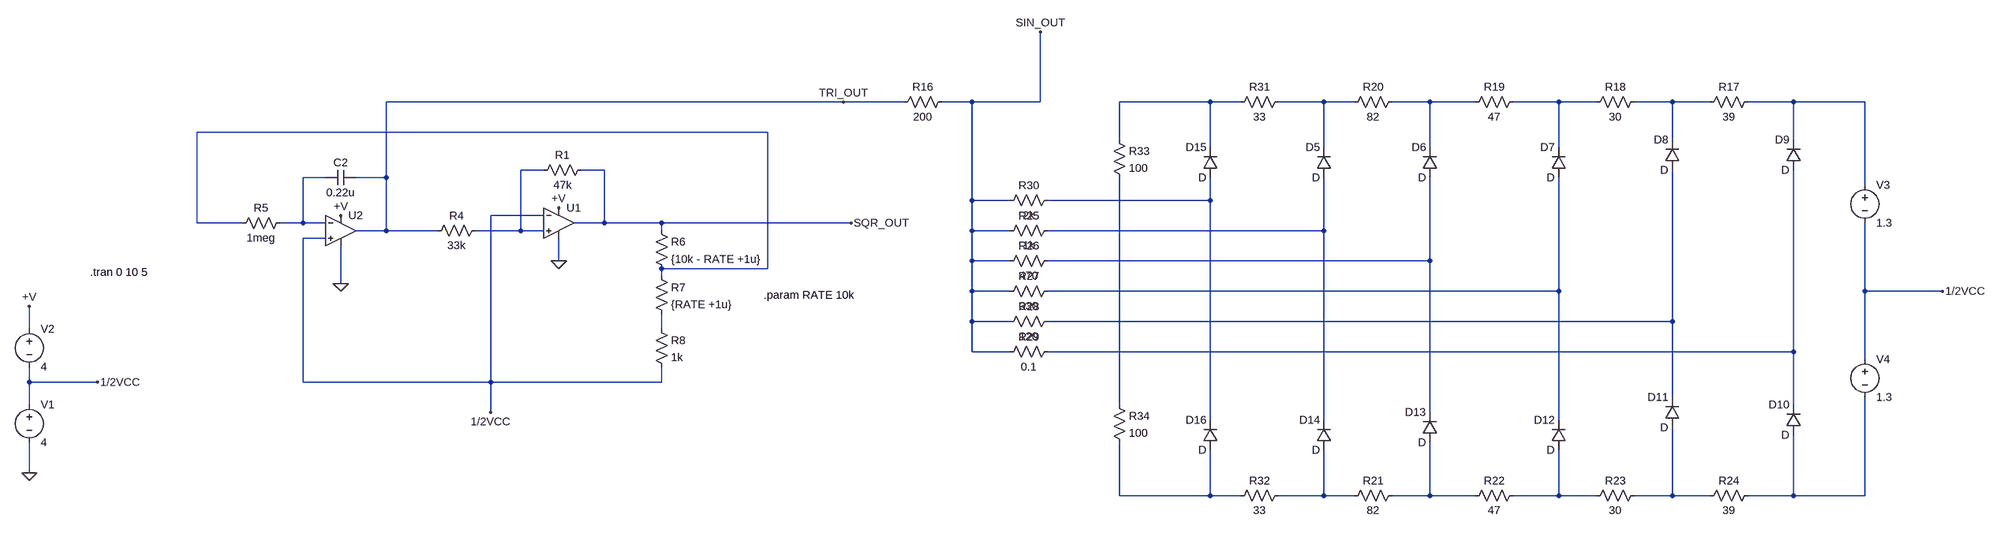
[diagram p0: schematic LFO_TRI_SIN.asc]
LFO_TRI_SIN.asc, the LTspice schematic file:
Version 4
SHEET 1 880 792
WIRE -2032 -1312 -3008 -1312
WIRE -1904 -1312 -2032 -1312
WIRE -1760 -1312 -1824 -1312
WIRE -1616 -1312 -1616 -1472
WIRE -1616 -1312 -1760 -1312
WIRE -1200 -1312 -1392 -1312
WIRE -1136 -1312 -1200 -1312
WIRE -960 -1312 -1056 -1312
WIRE -896 -1312 -960 -1312
WIRE -736 -1312 -816 -1312
WIRE -640 -1312 -736 -1312
WIRE -464 -1312 -560 -1312
WIRE -384 -1312 -464 -1312
WIRE -224 -1312 -304 -1312
WIRE -144 -1312 -224 -1312
WIRE 32 -1312 -64 -1312
WIRE 448 -1312 32 -1312
WIRE -2192 -1248 -3408 -1248
WIRE -1392 -1232 -1392 -1312
WIRE -224 -1232 -224 -1312
WIRE 32 -1232 32 -1312
WIRE -1200 -1216 -1200 -1312
WIRE -960 -1216 -960 -1312
WIRE -736 -1216 -736 -1312
WIRE -464 -1216 -464 -1312
WIRE -2672 -1168 -2720 -1168
WIRE -2544 -1168 -2592 -1168
WIRE -3136 -1152 -3184 -1152
WIRE -3008 -1152 -3008 -1312
WIRE -3008 -1152 -3072 -1152
WIRE 448 -1136 448 -1312
WIRE -1760 -1104 -1760 -1312
WIRE -1680 -1104 -1760 -1104
WIRE -1200 -1104 -1200 -1152
WIRE -1200 -1104 -1600 -1104
WIRE -2672 -1072 -2784 -1072
WIRE -3408 -1056 -3408 -1248
WIRE -3312 -1056 -3408 -1056
WIRE -3184 -1056 -3184 -1152
WIRE -3184 -1056 -3232 -1056
WIRE -3136 -1056 -3184 -1056
WIRE -2544 -1056 -2544 -1168
WIRE -2544 -1056 -2608 -1056
WIRE -2416 -1056 -2544 -1056
WIRE -2016 -1056 -2416 -1056
WIRE -3008 -1040 -3008 -1152
WIRE -3008 -1040 -3072 -1040
WIRE -2896 -1040 -3008 -1040
WIRE -2720 -1040 -2720 -1168
WIRE -2720 -1040 -2816 -1040
WIRE -2672 -1040 -2720 -1040
WIRE -2416 -1040 -2416 -1056
WIRE -1760 -1040 -1760 -1104
WIRE -1680 -1040 -1760 -1040
WIRE -960 -1040 -960 -1152
WIRE -960 -1040 -1600 -1040
WIRE -3136 -1024 -3184 -1024
WIRE -2640 -976 -2640 -1024
WIRE -1760 -976 -1760 -1040
WIRE -1680 -976 -1760 -976
WIRE -736 -976 -736 -1152
WIRE -736 -976 -1600 -976
WIRE -2192 -960 -2192 -1248
WIRE -2192 -960 -2416 -960
WIRE -2416 -944 -2416 -960
WIRE -3104 -928 -3104 -1008
WIRE -1760 -912 -1760 -976
WIRE -1680 -912 -1760 -912
WIRE -464 -912 -464 -1152
WIRE -464 -912 -1600 -912
WIRE 448 -912 448 -1056
WIRE 752 -912 448 -912
WIRE -1760 -848 -1760 -912
WIRE -1680 -848 -1760 -848
WIRE -224 -848 -224 -1168
WIRE -224 -848 -1600 -848
WIRE -3872 -832 -3872 -880
WIRE -2416 -832 -2416 -864
WIRE -1760 -784 -1760 -848
WIRE -1680 -784 -1760 -784
WIRE 32 -784 32 -1168
WIRE 32 -784 -1600 -784
WIRE 448 -768 448 -912
WIRE -3872 -720 -3872 -752
WIRE -3728 -720 -3872 -720
WIRE -3184 -720 -3184 -1024
WIRE -2784 -720 -2784 -1072
WIRE -2784 -720 -3184 -720
WIRE -2416 -720 -2416 -752
WIRE -2416 -720 -2784 -720
WIRE -224 -688 -224 -848
WIRE -3872 -672 -3872 -720
WIRE -1392 -672 -1392 -1152
WIRE 32 -672 32 -784
WIRE -2784 -656 -2784 -720
WIRE -736 -656 -736 -976
WIRE -1200 -640 -1200 -1104
WIRE -960 -640 -960 -1040
WIRE -464 -640 -464 -912
WIRE -3872 -528 -3872 -592
WIRE -1392 -480 -1392 -592
WIRE -1200 -480 -1200 -576
WIRE -1200 -480 -1392 -480
WIRE -1136 -480 -1200 -480
WIRE -960 -480 -960 -576
WIRE -960 -480 -1056 -480
WIRE -896 -480 -960 -480
WIRE -736 -480 -736 -592
WIRE -736 -480 -816 -480
WIRE -640 -480 -736 -480
WIRE -464 -480 -464 -576
WIRE -464 -480 -560 -480
WIRE -384 -480 -464 -480
WIRE -224 -480 -224 -624
WIRE -224 -480 -304 -480
WIRE -144 -480 -224 -480
WIRE 32 -480 32 -608
WIRE 32 -480 -64 -480
WIRE 448 -480 448 -688
WIRE 448 -480 32 -480
FLAG -3872 -528 0
FLAG -3872 -880 +V
FLAG -2640 -1088 +V
FLAG -2640 -976 0
FLAG -3104 -1072 +V
FLAG -3104 -928 0
FLAG -2784 -656 1/2VCC
FLAG -2016 -1056 SQR_OUT
FLAG -2032 -1312 TRI_OUT
FLAG -3728 -720 1/2VCC
FLAG 752 -912 1/2VCC
FLAG -1616 -1472 SIN_OUT
SYMBOL voltage -3872 -688 R0
WINDOW 123 0 0 Left 2
WINDOW 39 0 0 Left 2
SYMATTR InstName V1
SYMATTR Value 4
SYMBOL res -2576 -1184 R90
WINDOW 0 0 56 VBottom 2
WINDOW 3 32 56 VTop 2
SYMATTR InstName R1
SYMATTR Value 47k
SYMBOL res -2800 -1056 R90
WINDOW 0 0 56 VBottom 2
WINDOW 3 32 56 VTop 2
SYMATTR InstName R4
SYMATTR Value 33k
SYMBOL res -3216 -1072 R90
WINDOW 0 0 56 VBottom 2
WINDOW 3 32 56 VTop 2
SYMATTR InstName R5
SYMATTR Value 1meg
SYMBOL res -2432 -1056 R0
SYMATTR InstName R6
SYMATTR Value {10k - RATE +1u}
SYMBOL res -2432 -960 R0
SYMATTR InstName R7
SYMATTR Value {RATE +1u}
SYMBOL cap -3072 -1168 R90
WINDOW 0 0 32 VBottom 2
WINDOW 3 32 32 VTop 2
SYMATTR InstName C2
SYMATTR Value 0.22u
SYMBOL res -2432 -848 R0
SYMATTR InstName R8
SYMATTR Value 1k
SYMBOL Opamps\\UniversalOpamp2 -2640 -1056 R0
SYMATTR InstName U1
SYMBOL Opamps\\UniversalOpamp2 -3104 -1040 R0
SYMATTR InstName U2
SYMBOL voltage -3872 -848 R0
WINDOW 123 0 0 Left 2
WINDOW 39 0 0 Left 2
SYMATTR InstName V2
SYMATTR Value 4
SYMBOL res -1808 -1328 R90
WINDOW 0 0 56 VBottom 2
WINDOW 3 32 56 VTop 2
SYMATTR InstName R16
SYMATTR Value 200
SYMBOL diode -944 -1152 R180
WINDOW 0 24 64 Left 2
WINDOW 3 24 0 Left 2
SYMATTR InstName D5
SYMBOL diode -720 -1152 R180
WINDOW 0 24 64 Left 2
WINDOW 3 24 0 Left 2
SYMATTR InstName D6
SYMBOL diode -448 -1152 R180
WINDOW 0 24 64 Left 2
WINDOW 3 24 0 Left 2
SYMATTR InstName D7
SYMBOL diode -208 -1168 R180
WINDOW 0 24 64 Left 2
WINDOW 3 24 0 Left 2
SYMATTR InstName D8
SYMBOL diode 48 -1168 R180
WINDOW 0 24 64 Left 2
WINDOW 3 24 0 Left 2
SYMATTR InstName D9
SYMBOL diode 48 -608 R180
WINDOW 0 24 64 Left 2
WINDOW 3 24 0 Left 2
SYMATTR InstName D10
SYMBOL diode -208 -624 R180
WINDOW 0 24 64 Left 2
WINDOW 3 24 0 Left 2
SYMATTR InstName D11
SYMBOL diode -448 -576 R180
WINDOW 0 24 64 Left 2
WINDOW 3 24 0 Left 2
SYMATTR InstName D12
SYMBOL diode -720 -592 R180
WINDOW 0 24 64 Left 2
WINDOW 3 24 0 Left 2
SYMATTR InstName D13
SYMBOL diode -944 -576 R180
WINDOW 0 24 64 Left 2
WINDOW 3 24 0 Left 2
SYMATTR InstName D14
SYMBOL res -48 -1328 R90
WINDOW 0 0 56 VBottom 2
WINDOW 3 32 56 VTop 2
SYMATTR InstName R17
SYMATTR Value 39
SYMBOL res -288 -1328 R90
WINDOW 0 0 56 VBottom 2
WINDOW 3 32 56 VTop 2
SYMATTR InstName R18
SYMATTR Value 30
SYMBOL res -544 -1328 R90
WINDOW 0 0 56 VBottom 2
WINDOW 3 32 56 VTop 2
SYMATTR InstName R19
SYMATTR Value 47
SYMBOL res -800 -1328 R90
WINDOW 0 0 56 VBottom 2
WINDOW 3 32 56 VTop 2
SYMATTR InstName R20
SYMATTR Value 82
SYMBOL res -800 -496 R90
WINDOW 0 0 56 VBottom 2
WINDOW 3 32 56 VTop 2
SYMATTR InstName R21
SYMATTR Value 82
SYMBOL res -544 -496 R90
WINDOW 0 0 56 VBottom 2
WINDOW 3 32 56 VTop 2
SYMATTR InstName R22
SYMATTR Value 47
SYMBOL res -288 -496 R90
WINDOW 0 0 56 VBottom 2
WINDOW 3 32 56 VTop 2
SYMATTR InstName R23
SYMATTR Value 30
SYMBOL res -48 -496 R90
WINDOW 0 0 56 VBottom 2
WINDOW 3 32 56 VTop 2
SYMATTR InstName R24
SYMATTR Value 39
SYMBOL res -1584 -1056 R90
WINDOW 0 0 56 VBottom 2
WINDOW 3 32 56 VTop 2
SYMATTR InstName R25
SYMATTR Value 1k
SYMBOL res -1584 -992 R90
WINDOW 0 0 56 VBottom 2
WINDOW 3 32 56 VTop 2
SYMATTR InstName R26
SYMATTR Value 470
SYMBOL res -1584 -928 R90
WINDOW 0 0 56 VBottom 2
WINDOW 3 32 56 VTop 2
SYMATTR InstName R27
SYMATTR Value 330
SYMBOL res -1584 -864 R90
WINDOW 0 0 56 VBottom 2
WINDOW 3 32 56 VTop 2
SYMATTR InstName R28
SYMATTR Value 120
SYMBOL res -1584 -800 R90
WINDOW 0 0 56 VBottom 2
WINDOW 3 32 56 VTop 2
SYMATTR InstName R29
SYMATTR Value 0.1
SYMBOL res -1584 -1120 R90
WINDOW 0 0 56 VBottom 2
WINDOW 3 32 56 VTop 2
SYMATTR InstName R30
SYMATTR Value 2k
SYMBOL diode -1184 -1152 R180
WINDOW 0 24 64 Left 2
WINDOW 3 24 0 Left 2
SYMATTR InstName D15
SYMBOL diode -1184 -576 R180
WINDOW 0 24 64 Left 2
WINDOW 3 24 0 Left 2
SYMATTR InstName D16
SYMBOL res -1040 -1328 R90
WINDOW 0 0 56 VBottom 2
WINDOW 3 32 56 VTop 2
SYMATTR InstName R31
SYMATTR Value 33
SYMBOL res -1040 -496 R90
WINDOW 0 0 56 VBottom 2
WINDOW 3 32 56 VTop 2
SYMATTR InstName R32
SYMATTR Value 33
SYMBOL res -1408 -1248 R0
SYMATTR InstName R33
SYMATTR Value 100
SYMBOL res -1408 -688 R0
SYMATTR InstName R34
SYMATTR Value 100
SYMBOL voltage 448 -1152 R0
WINDOW 123 0 0 Left 2
WINDOW 39 0 0 Left 2
SYMATTR InstName V3
SYMATTR Value 1.3
SYMBOL voltage 448 -784 R0
WINDOW 123 0 0 Left 2
WINDOW 39 0 0 Left 2
SYMATTR InstName V4
SYMATTR Value 1.3
TEXT -2200 -904 Left 2 !.param RATE 10k
TEXT -3744 -952 Left 2 !.tran 0 10 5

The netlist it stands for:
* LFO_TRI_SIN.asc
V1 1/2VCC 0 4
R1 SQR_OUT N008 47k
R4 N008 TRI_OUT 33k
R5 N009 N007 1meg
R6 SQR_OUT N007 {10k - RATE +1u}
R7 N007 N015 {RATE +1u}
C2 TRI_OUT N009 0.22u
R8 N015 1/2VCC 1k
XU1 N008 1/2VCC +V 0 SQR_OUT level.2 Avol=1Meg GBW=10Meg Slew=10Meg ilimit=25m rail=0 Vos=0 phimargin=45 en=0 enk=0 in=0 ink=0 Rin=500Meg  ; pins IN+ IN- V+ V- OUT
XU2 1/2VCC N009 +V 0 TRI_OUT level.2 Avol=1Meg GBW=10Meg Slew=10Meg ilimit=25m rail=0 Vos=0 phimargin=45 en=0 enk=0 in=0 ink=0 Rin=500Meg  ; pins IN+ IN- V+ V- OUT
V2 +V 1/2VCC 4
R16 SIN_OUT TRI_OUT 200
D5 N011 N002 D
D6 N012 N003 D
D7 N013 N004 D
D8 N014 N005 D
D9 N016 N006 D
D10 N023 N016 D
D11 N022 N014 D
D12 N021 N013 D
D13 N020 N012 D
D14 N019 N011 D
R17 N006 N005 39
R18 N005 N004 30
R19 N004 N003 47
R20 N003 N002 82
R21 N020 N019 82
R22 N021 N020 47
R23 N022 N021 30
R24 N023 N022 39
R25 N011 SIN_OUT 1k
R26 N012 SIN_OUT 470
R27 N013 SIN_OUT 330
R28 N014 SIN_OUT 120
R29 N016 SIN_OUT 0.1
R30 N010 SIN_OUT 2k
D15 N010 N001 D
D16 N018 N010 D
R31 N002 N001 33
R32 N019 N018 33
R33 N001 N017 100
R34 N017 N018 100
V3 N006 1/2VCC 1.3
V4 1/2VCC N023 1.3
.model D D
.lib standard.dio
.param RATE 10k
.tran 0 10 5
.lib UniversalOpamps2.sub
.backanno
.end